# EAGLE schematic MC10_Tape (EAGLE 6.6.0)
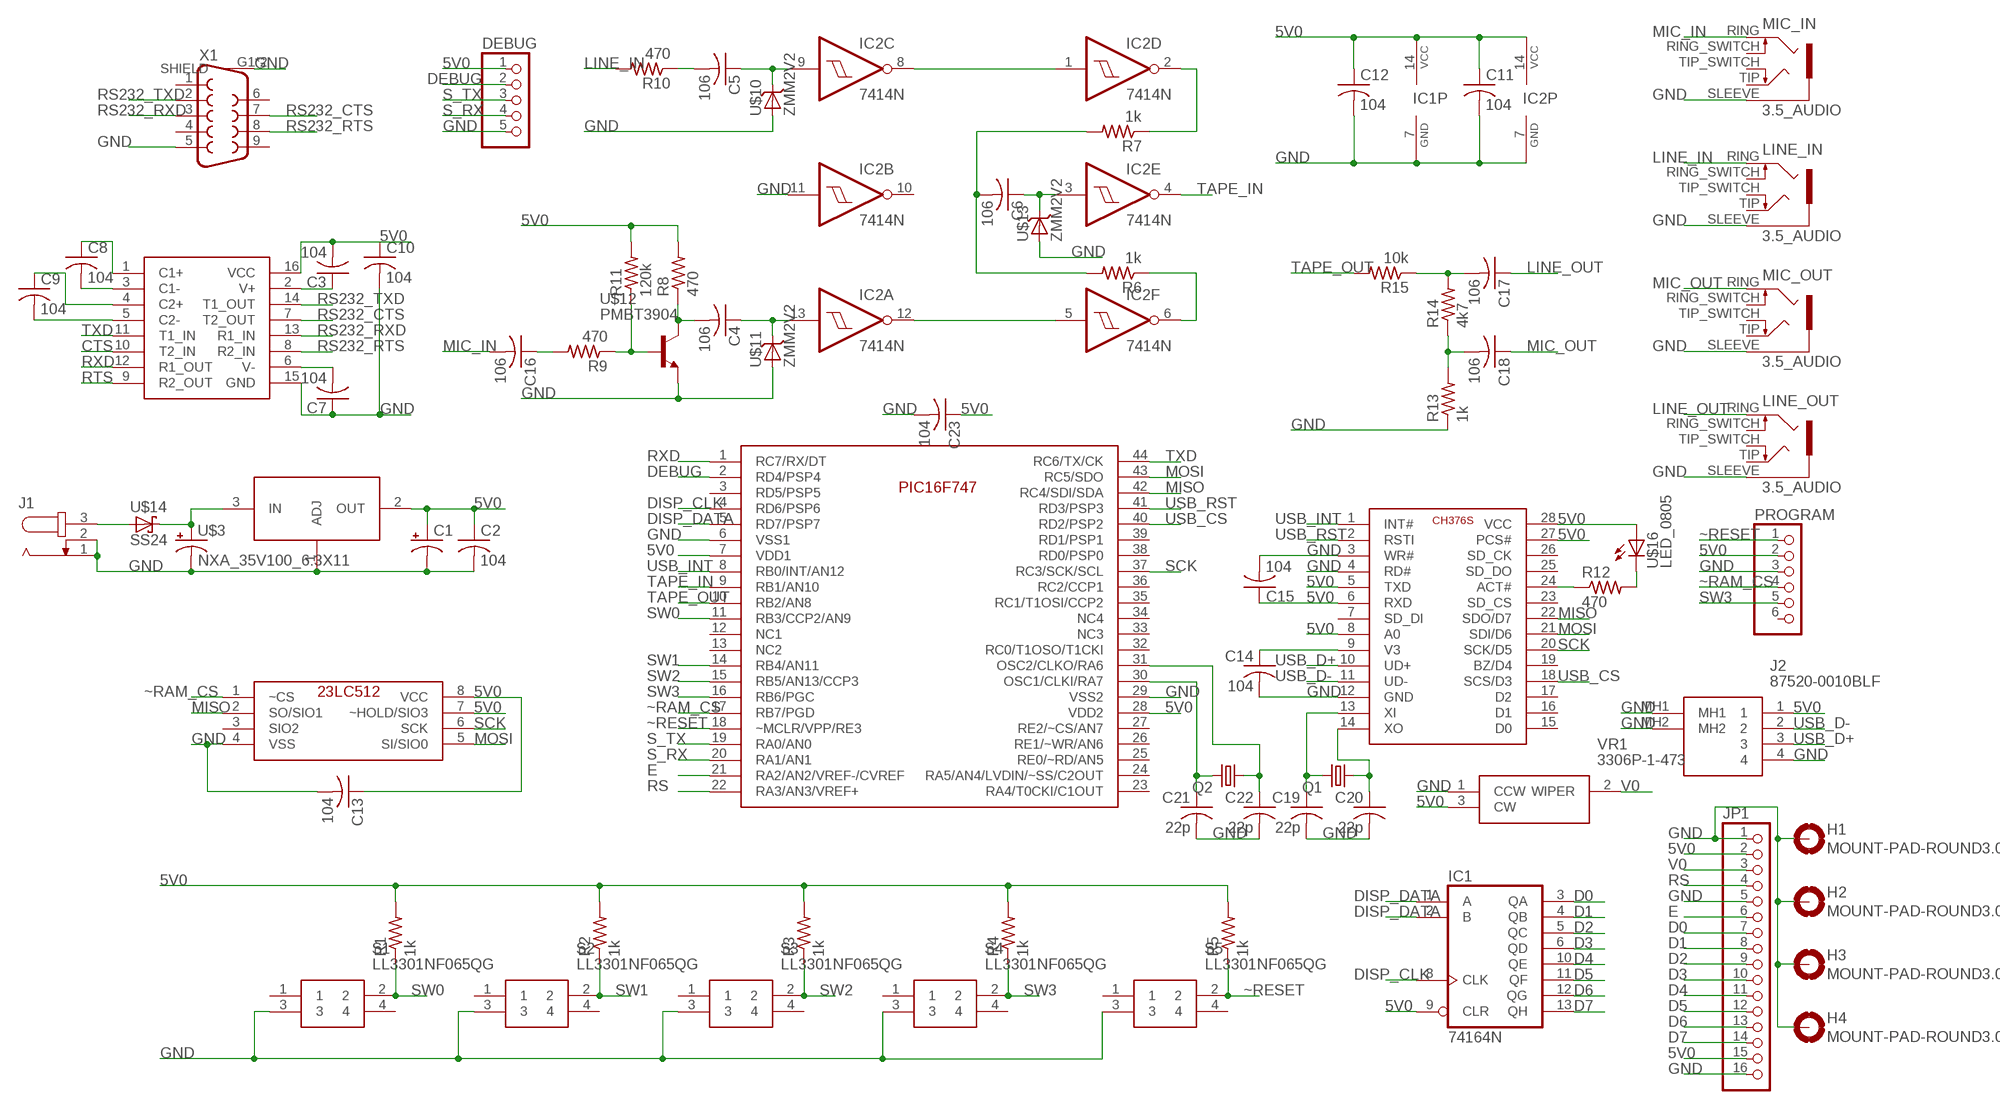
[diagram p0: schematic, sheet 1]

## Parts
C1  CPOL-USUD-6,3X5,8  [UD-6,3X5,8_NICHICON]
C2  104  C-USC0805  [C0805]
C3  104  C-USC0805  [C0805]
C4  106  C-USC1206  [C1206]
C5  106  C-USC1206  [C1206]
C6  106  C-USC1206  [C1206]
C7  104  C-USC0805  [C0805]
C8  104  C-USC0805  [C0805]
C9  104  C-USC0805  [C0805]
C10  104  C-USC0805  [C0805]
C11  104  C-USC0805  [C0805]
C12  104  C-USC0805  [C0805]
C13  104  C-USC0805  [C0805]
C14  104  C-USC0805  [C0805]
C15  104  C-USC0805  [C0805]
C16  106  C-USC1206  [C1206]
C17  106  C-USC1206  [C1206]
C18  106  C-USC1206  [C1206]
C19  22p  C-USC0805  [C0805]
C20  22p  C-USC0805  [C0805]
C21  22p  C-USC0805  [C0805]
C22  22p  C-USC0805  [C0805]
C23  104  C-USC0805  [C0805]
DEBUG  PINHD-1X5  [1X05]
H1  MOUNT-PAD-ROUND3.0  [3,0-PAD]
H2  MOUNT-PAD-ROUND3.0  [3,0-PAD]
H3  MOUNT-PAD-ROUND3.0  [3,0-PAD]
H4  MOUNT-PAD-ROUND3.0  [3,0-PAD]
IC1  74164N  [DIL14]
IC2  7414N  [DIL14]
J1  JACK-PLUG0  [SPC4077]
J2  87520-0010BLF  [875200010BLF]
JP1  PINHD-1X16  [1X16]
LINE_IN  3.5_AUDIO  [3.5_AUDIO]
LINE_OUT  3.5_AUDIO  [3.5_AUDIO]
MIC_IN  3.5_AUDIO  [3.5_AUDIO]
MIC_OUT  3.5_AUDIO  [3.5_AUDIO]
PROGRAM  PINHD-1X6  [1X06]
Q1  CRYSTALHC49S  [HC49/S]
Q2  CRYSTALHC49S  [HC49/S]
R1  1k  R-US_M0805  [M0805]
R2  1k  R-US_M0805  [M0805]
R3  1k  R-US_M0805  [M0805]
R4  1k  R-US_M0805  [M0805]
R5  1k  R-US_M0805  [M0805]
R6  1k  R-US_M0805  [M0805]
R7  1k  R-US_M0805  [M0805]
R8  470  R-US_M0805  [M0805]
R9  470  R-US_M0805  [M0805]
R10  470  R-US_M0805  [M0805]
R11  120k  R-US_M0805  [M0805]
R12  470  R-US_M0805  [M0805]
R13  1k  R-US_M0805  [M0805]
R14  4k7  R-US_M0805  [M0805]
R15  10k  R-US_M0805  [M0805]
S1  LL3301NF065QG  [LL3301NF065QG]
S2  LL3301NF065QG  [LL3301NF065QG]
S3  LL3301NF065QG  [LL3301NF065QG]
S4  LL3301NF065QG  [LL3301NF065QG]
S5  LL3301NF065QG  [LL3301NF065QG]
U$1  PIC16F747-IPT  [TQFP44]
U$2  LM1086  [D2PACK]
U$3  NXA_35V100_6.3X11  [NXA_35V100_6.3X11]
U$4  23LC512T-ISN  [SO08]
U$9  SP232  [SOP16]
U$10  ZMM2V2  [SOD80C]
U$11  ZMM2V2  [SOD80C]
U$12  PMBT3904  [SOT23]
U$13  ZMM2V2  [SOD80C]
U$14  SS24  [SMA-DO214AC]
U$15  CH376S  [SOP28]
U$16  LED_0805  [CHIP-LED0805]
VR1  3306P-1-473  [3306P1104]
X1  F09HP  [F09HP]

## Nets
5V0: C1.+ C2.1 C3.2 C10.1 C11.1 C12.1 C13.1 C15.1 C23.1 DEBUG.1 IC1.9(CLR) IC1.14(VCC) IC2.14(P:VCC) J2.1 JP1.2 JP1.15 PROGRAM.2 R1.2 R2.2 R3.2 R4.2 R5.2 R8.2 R11.2 U$1.7(VDD1) U$1.28(VDD2) U$2.2(OUT) U$4.7(~HOLD/SIO3) U$4.8(VCC) U$9.16(VCC) U$15.5(TXD) U$15.6(RXD) U$15.8(A0) U$15.27(PCS#) U$15.28(VCC) U$16.A VR1.3(CW)
CTS: U$9.10(T2_IN)
D0: IC1.3(QA) JP1.7
D1: IC1.4(QB) JP1.8
D2: IC1.5(QC) JP1.9
D3: IC1.6(QD) JP1.10
D4: IC1.10(QE) JP1.11
D5: IC1.11(QF) JP1.12
D6: IC1.12(QG) JP1.13
D7: IC1.13(QH) JP1.14
DEBUG: DEBUG.2 U$1.2(RD4/PSP4)
DISP_CLK: IC1.8(CLK) U$1.4(RD6/PSP6)
DISP_DATA: IC1.1(A) IC1.2(B) U$1.5(RD7/PSP7)
E: JP1.6 U$1.21(RA2/AN2/VREF-/CVREF)
GND: C1.- C2.2 C7.1 C10.2 C11.2 C12.2 C13.2 C14.2 C15.2 C19.2 C20.2 C21.2 C22.2 C23.2 DEBUG.5 H1.B3,0(MOUNT) H2.B3,0(MOUNT) H3.B3,0(MOUNT) H4.B3,0(MOUNT) IC1.7(GND) IC2.7(P:GND) IC2.11(B:I) J1.1 J1.2 J2.4 J2.MH1 J2.MH2 JP1.1 JP1.5 JP1.16 LINE_IN.SLEEVE LINE_OUT.SLEEVE MIC_IN.SLEEVE MIC_OUT.SLEEVE PROGRAM.3 R13.1 S1.3 S2.3 S3.3 S4.3 S5.3 U$1.6(VSS1) U$1.29(VSS2) U$2.1(ADJ) U$3.P$1(-) U$4.4(VSS) U$9.15(GND) U$10.A U$11.A U$12.2(E) U$13.A U$15.3(WR#) U$15.4(RD#) U$15.12(GND) VR1.1(CCW) X1.5 X1.G1(SHIELD) X1.G2(SHIELD)
LINE_IN: LINE_IN.RING R10.2
LINE_OUT: C17.1 LINE_OUT.RING
MIC_IN: C16.2 MIC_IN.RING
MIC_OUT: C18.1 MIC_OUT.RING
MISO: U$1.42(RC4/SDI/SDA) U$4.2(SO/SIO1) U$15.22(SDO/D7)
MOSI: U$1.43(RC5/SDO) U$4.5(SI/SIO0) U$15.21(SDI/D6)
N$1: C5.1 IC2.9(C:I) U$10.C
N$2: U$2.3(IN) U$3.P$2(+) U$14.K(C)
N$3: C6.1 IC2.3(E:I) U$13.C
N$4: IC2.1(D:I) IC2.8(C:O)
N$5: IC2.5(F:I) IC2.12(A:O)
N$6: C14.1 U$15.9(V3)
N$7: C4.2 R8.1 U$12.3(C)
N$8: C4.1 IC2.13(A:I) U$11.C
N$9: R9.1 R11.1 U$12.1(B)
N$10: C17.2 R14.2 R15.1
N$11: R12.2 U$16.C
N$12: C16.1 R9.2
N$13: IC2.6(F:O) R6.1
N$14: C6.2 R6.2 R7.2
N$15: IC2.2(D:O) R7.1
N$16: C18.2 R13.2 R14.1
N$17: C21.1 Q2.2 U$1.30(OSC1/CLKI/RA7)
N$18: C20.1 Q1.1 U$15.14(XO)
N$19: C19.1 Q1.2 U$15.13(XI)
N$20: C22.1 Q2.1 U$1.31(OSC2/CLKO/RA6)
N$21: R12.1 U$15.24(ACT#)
N$58: J1.3 U$14.A
N$59: C8.2 U$9.3(C1-)
N$60: C8.1 U$9.1(C1+)
N$61: C9.2 U$9.5(C2-)
N$62: C9.1 U$9.4(C2+)
N$64: C3.1 U$9.2(V+)
N$65: C7.2 U$9.6(V-)
N$68: C5.2 R10.1
RS: JP1.4 U$1.22(RA3/AN3/VREF+)
RS232_CTS: U$9.7(T2_OUT) X1.7
RS232_RTS: U$9.8(R2_IN) X1.8
RS232_RXD: U$9.13(R1_IN) X1.3
RS232_TXD: U$9.14(T1_OUT) X1.2
RTS: U$9.9(R2_OUT)
RXD: U$1.1(RC7/RX/DT) U$9.12(R1_OUT)
S_RX: DEBUG.4 U$1.20(RA1/AN1)
S_TX: DEBUG.3 U$1.19(RA0/AN0)
SCK: U$1.37(RC3/SCK/SCL) U$4.6(SCK) U$15.20(SCK/D5)
SW0: R1.1 S1.2 U$1.11(RB3/CCP2/AN9)
SW1: R2.1 S2.2 U$1.14(RB4/AN11)
SW2: R3.1 S3.2 U$1.15(RB5/AN13/CCP3)
SW3: PROGRAM.5 R4.1 S4.2 U$1.16(RB6/PGC)
TAPE_IN: IC2.4(E:O) U$1.9(RB1/AN10)
TAPE_OUT: R15.2 U$1.10(RB2/AN8)
TXD: U$1.44(RC6/TX/CK) U$9.11(T1_IN)
USB_CS: U$1.40(RD2/PSP2) U$15.18(SCS/D3)
USB_D+: J2.3 U$15.10(UD+)
USB_D-: J2.2 U$15.11(UD-)
USB_INT: U$1.8(RB0/INT/AN12) U$15.1(INT#)
USB_RST: U$1.41(RD3/PSP3) U$15.2(RSTI)
V0: JP1.3 VR1.2(WIPER)
~RAM_CS: PROGRAM.4 U$1.17(RB7/PGD) U$4.1(~CS)
~RESET: PROGRAM.1 R5.1 S5.2 U$1.18(~MCLR/VPP/RE3)
Unconnected: IC2.10(B:O) LINE_IN.RING_SWITCH LINE_IN.TIP LINE_IN.TIP_SWITCH LINE_OUT.RING_SWITCH LINE_OUT.TIP LINE_OUT.TIP_SWITCH MIC_IN.RING_SWITCH MIC_IN.TIP MIC_IN.TIP_SWITCH MIC_OUT.RING_SWITCH MIC_OUT.TIP MIC_OUT.TIP_SWITCH PROGRAM.6 S1.1 S1.4 S2.1 S2.4 S3.1 S3.4 S4.1 S4.4 S5.1 S5.4 U$1.3(RD5/PSP5) U$1.12(NC1) U$1.13(NC2) U$1.23(RA4/T0CKI/C1OUT) U$1.24(RA5/AN4/LVDIN/~SS/C2OUT) U$1.25(RE0/~RD/AN5) U$1.26(RE1/~WR/AN6) U$1.27(RE2/~CS/AN7) U$1.32(RC0/T1OSO/T1CKI) U$1.33(NC3) U$1.34(NC4) U$1.35(RC1/T1OSI/CCP2) U$1.36(RC2/CCP1) U$1.38(RD0/PSP0) U$1.39(RD1/PSP1) U$4.3(SIO2) U$15.7(SD_DI) U$15.15(D0) U$15.16(D1) U$15.17(D2) U$15.19(BZ/D4) U$15.23(SD_CS) U$15.25(SD_DO) U$15.26(SD_CK) X1.1 X1.4 X1.6 X1.9

## Library data of the parts
C1 = rcl:CPOL-US: POLARIZED CAPACITOR, American symbol
C2-C23 = rcl:C-US: CAPACITOR, American symbol
DEBUG = pinhead:PINHD-1X5: PIN HEADER
H1-H4 = holes:MOUNT-PAD-ROUND: MOUNTING PAD, round
IC1 = 74xx-us:74*164: 8-bit parallel out SHIFT REGISTER
IC2 = 74xx-us:74*14: Hex schmitt trigger INVERTER
J1 = con-jack:JACK-PLUG: DC POWER JACK Power Jack, DC, Right Angle, Through Hole, Rated 5A at 16VDC, PC Terminals Distributor: Farnell (www.Farnell.de) Drawing: 84N1161.pdf / 84N1162.pdf Manufacturer: SPC Technology (www.spctechnology.com) Type: SPC4077 / SPC 4078; OC_FARNELL: unknown; OC_NEWARK: unknown
J2 = Signetics:87520-0010BLF: USB 2.0 Type A receptacle white Source: Datasheet <https://componentsearchengine.com/Datasheets/1/87520-0010BLF.pdf>; DESCRIPTION: USB 2.0 Type A receptacle white; HEIGHT: 7.8mm; MANUFACTURER_NAME: Amphenol; MANUFACTURER_PART_NUMBER: 87520-0010BLF; MOUSER_PART_NUMBER: 649-87520-0010BLF; MOUSER_PRICE-STOCK: https://www.mouser.co.uk/ProductDetail/Amphenol-FCI/87520-0010BLF?qs=x6EjVpvqMVP%2F2to87x7cdQ%3D%3D
JP1 = pinhead:PINHD-1X16: PIN HEADER
LINE_IN LINE_OUT MIC_IN MIC_OUT = Signetics:3.5_AUDIO
PROGRAM = pinhead:PINHD-1X6: PIN HEADER
Q1 Q2 = crystal:CRYSTAL: CRYSTAL; OC_FARNELL: 1667008; OC_NEWARK: unknown
R1-R15 = rcl:R-US_: RESISTOR, American symbol
S1-S5 = Signetics:LL3301NF065QG: E-SWITCH - LL3301NF065QG - TACTILE SW, SPST, 0.05A, 12VDC, SOLDER Source: Datasheet <http://spec_sheets.e-switch.com/specs/P090002.pdf>; DESCRIPTION: E-SWITCH - LL3301NF065QG - TACTILE SW, SPST, 0.05A, 12VDC, SOLDER; HEIGHT: 4mm; MANUFACTURER_NAME: E-Switch; MANUFACTURER_PART_NUMBER: LL3301NF065QG; MOUSER_PART_NUMBER: 612-LL3301NF065QG; MOUSER_PRICE-STOCK: https://www.mouser.co.uk/ProductDetail/E-Switch/LL3301NF065QG?qs=QtyuwXswaQiWhwgY68YTTw%3D%3D
U$1 = Signetics:PIC16F747-IPT
U$2 = Signetics:LM1086
U$3 = Signetics:NXA_35V100_6.3X11
U$4 = Signetics:23LC512T-ISN
U$9 = Signetics:SP232
U$10 U$11 U$13 = Signetics:ZMM2V2
U$12 = Signetics:PMBT3904
U$14 = Signetics:SS24
U$15 = Signetics:CH376S
U$16 = Signetics:LED_0805
VR1 = Signetics:3306P-1-473: Trimmer Resistors - Through Hole TRIMMER -SMD 6MM RD ST CERMET OPEN FRAME Source: Datasheet <https://www.bourns.com/docs/Product-Datasheets/3306.pdf>; DESCRIPTION: Trimmer Resistors - Through Hole TRIMMER -SMD 6MM RD ST CERMET OPEN FRAME; HEIGHT: 8.38mm; MANUFACTURER_NAME: Bourns; MANUFACTURER_PART_NUMBER: 3306P-1-473; MOUSER_PART_NUMBER: 652-3306P-1-473; MOUSER_PRICE-STOCK: https://www.mouser.co.uk/ProductDetail/Bourns/3306P-1-473?qs=BJlw7L4Cy79OzIXLuBSy4A%3D%3D
X1 = Signetics:F09: SUB-D; OC_FARNELL: unknown; OC_NEWARK: unknown